# Altium project TINYMODULE-V3.PrjPcb
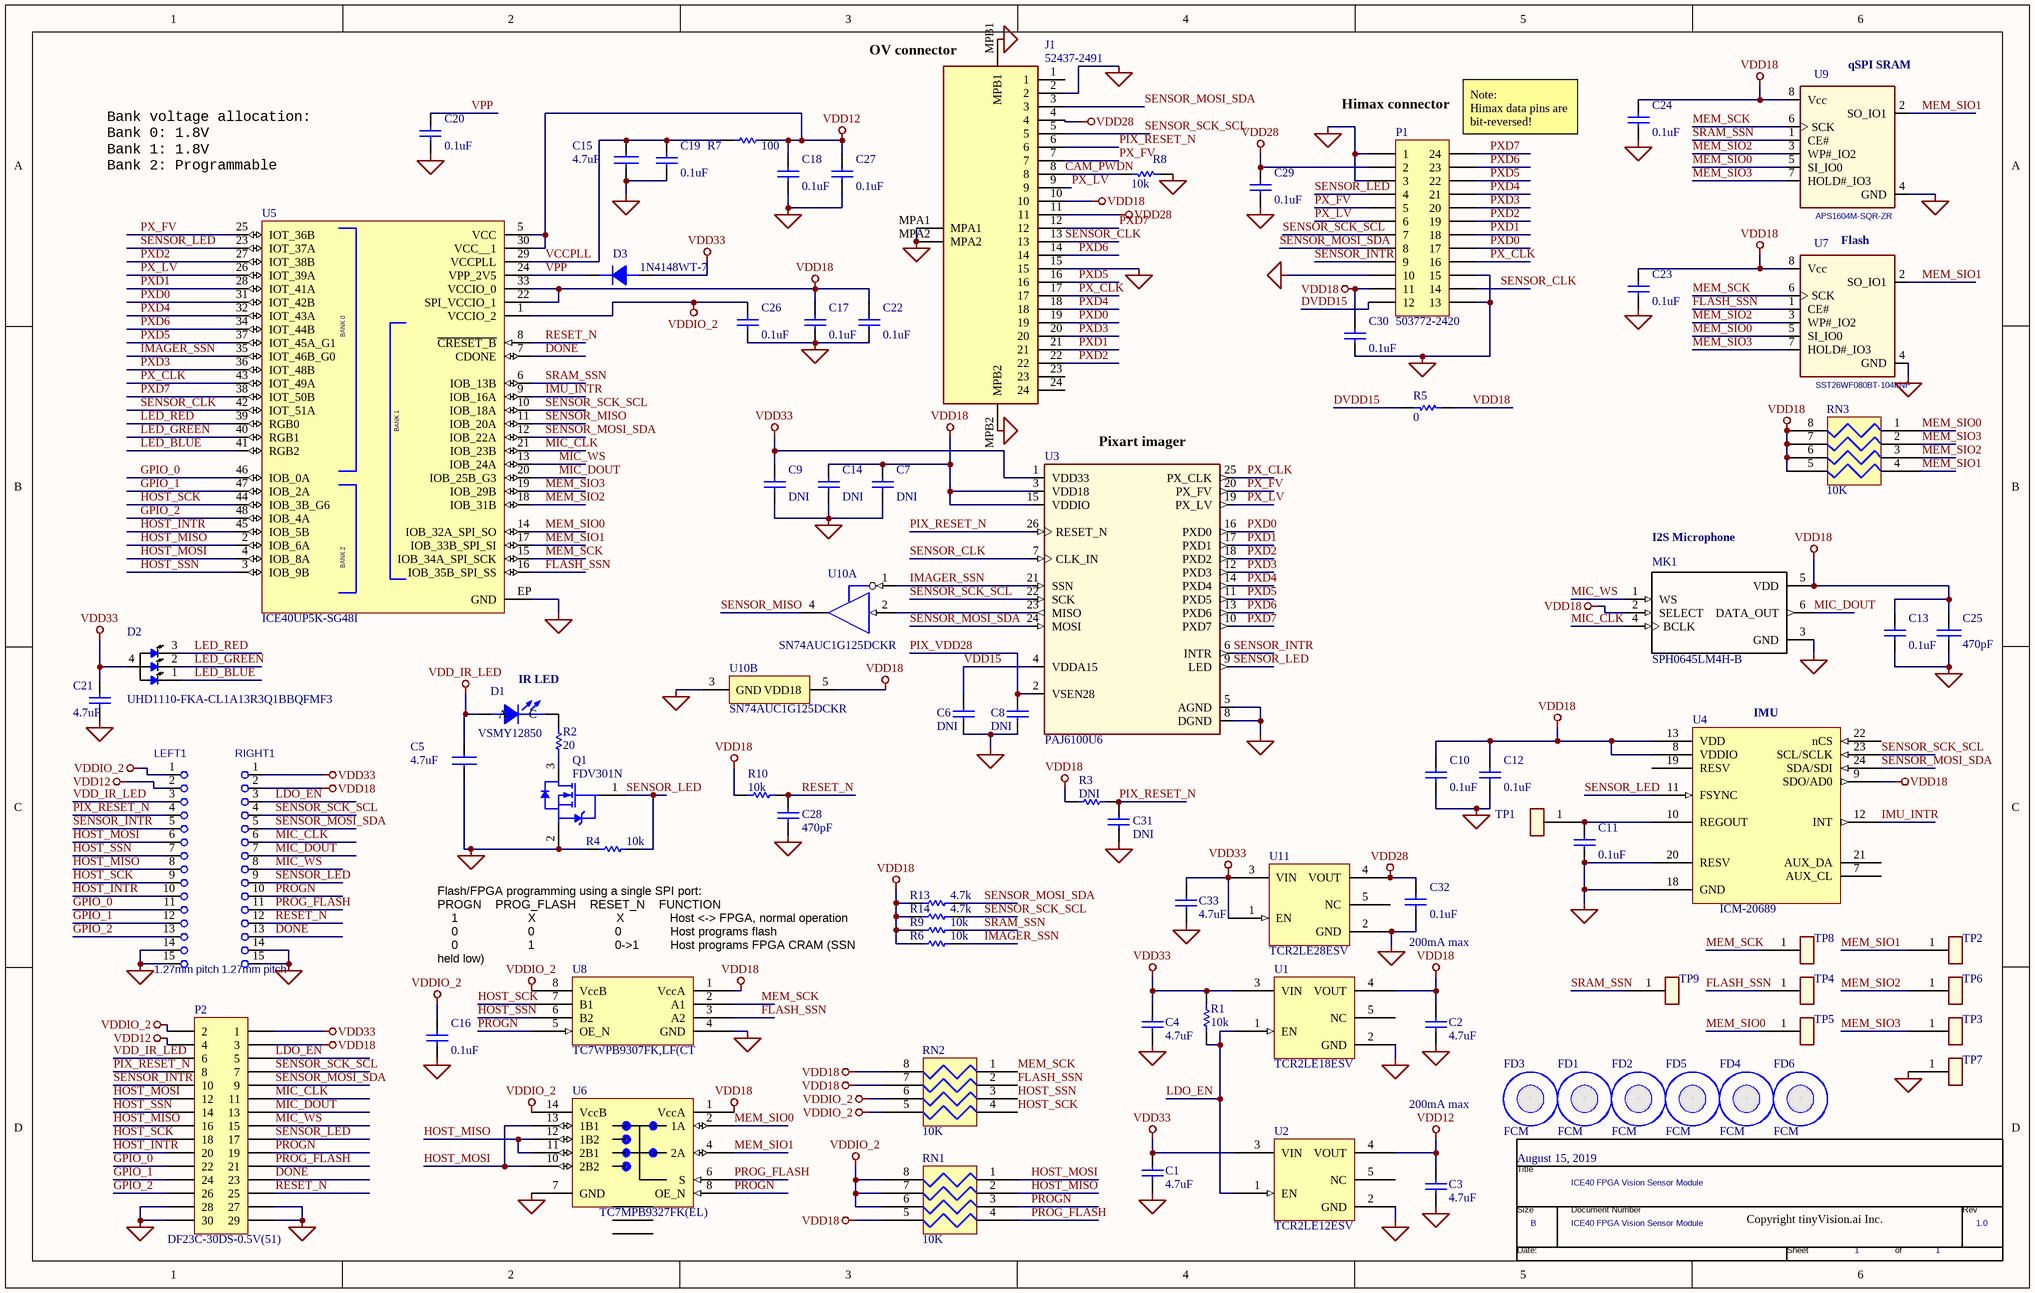
[diagram p0: TINYMODULE-V3.SchDoc]
1 sheet, 85 parts. Net scope: global (net labels, ports and power ports of the same name join across sheets).
Board file: TINYMODULE-V3.PcbDoc

## Sheet TINYMODULE-V3.SchDoc
size B

### Parts
*  Page Create Date: August 15, 2019  Page Count: 1  Page Size: B  Title: ICE40 FPGA Vision Sensor Module  RevCode: 1.0  (hidden comment: TitleBlock0)  (graphical)
C1  4.7uF  [CAPC100X50X60L25N]
C2  4.7uF  [CAPC100X50X60L25N]
C3  4.7uF  [CAPC100X50X60L25N]
C4  4.7uF  [CAPC100X50X60L25N]
C5  4.7uF  [CAPC100X50X60L25N]
C6  DNI  [CAPC100X50X60L25N]
C7  DNI  [CAPC100X50X60L25N]
C8  DNI  [CAPC100X50X60L25N]
C9  DNI  [CAPC100X50X60L25N]
C10  0.1uF  [CAPC100X50X60L25N]
C11  0.1uF  [CAPC100X50X60L25N]
C12  0.1uF  [CAPC100X50X60L25N]
C13  0.1uF  [CAPC100X50X60L25N]
C14  DNI  [CAPC100X50X60L25N]
C15  4.7uF  [CAPC100X50X60L25N]
C16  0.1uF  [CAPC100X50X60L25N]
C17  0.1uF  [CAPC100X50X60L25N]
C18  0.1uF  [CAPC100X50X60L25N]
C19  0.1uF  [CAPC100X50X60L25N]
C20  0.1uF  [CAPC100X50X60L25N]
C21  4.7uF  [CAPC100X50X60L25N]
C22  0.1uF  [CAPC100X50X60L25N]
C23  0.1uF  [CAPC100X50X60L25N]
C24  0.1uF  [CAPC100X50X60L25N]
C25  470pF  [CAPC100X50X60L25N]
C26  0.1uF  [CAPC100X50X60L25N]
C27  0.1uF  [CAPC100X50X60L25N]
C28  470pF  [CAPC100X50X60L25N]
C29  0.1uF  [CAPC100X50X60L25N]
C30  0.1uF  [CAPC100X50X60L25N]
C31  DNI  [CAPC100X50X60L25N]
C32  0.1uF  [CAPC100X50X60L25N]
C33  4.7uF  [CAPC100X50X60L25N]
D1  VSMY12850  [vsmy12850]
D2  UHD1110-FKA-CL1A13R3Q1BBQFMF3  [UHD1110-FKA]
D3  1N4148WT-7  [SOD523F]
FD1  FCM  [FID100X200N]
FD2  FCM  [FID100X200N]
FD3  FCM  [FID100X200N]
FD4  FCM  [FID100X200N]
FD5  FCM  [FID100X200N]
FD6  FCM  [FID100X200N]
J1  52437-2491  [524372491]
LEFT1  value 1.27mm pitch  [CONN_GENERIC_1.27mm_15cont]  (hidden comment: CONN_GENERIC_15)
MK1  SPH0645LM4H-B  [Knowles_SPH0645LM4H-B_0]
P1  503772-2420  [503772-2410]
P2  DF23C-30DS-0.5V(51)  [DF23C-30DS-0.5V]
Q1  FDV301N  [FAIR-SOT23-3_V]
R1  10k  [RESC100X50X40L25N]
R2  20  [RESC1608X55N]
R3  DNI  [RESC100X50X40L25N]
R4  10k  [RESC100X50X40L25N]
R5  0  [RESC100X50X40L25N]
R6  10k  [RESC100X50X40L25N]
R7  100  [RESC100X50X40L25N]
R8  10k  [RESC100X50X40L25N]
R9  10k  [RESC100X50X40L25N]
R10  10k  [RESC100X50X40L25N]
R13  4.7k  [RESC100X50X40L25N]
R14  4.7k  [RESC100X50X40L25N]
RIGHT1  value 1.27mm pitch  [CONN_GENERIC_1.27mm_15cont]  (hidden comment: CONN_GENERIC_15)
RN1  10K  [RESCAXS50P100X200X45-8NA]
RN2  10K  [RESCAXS50P100X200X45-8NA]
RN3  10K  [RESCAXS50P100X200X45-8NA]
TP1  TEST POINT  [TP-R20]  (value not drawn)
TP2  TEST POINT  [TP-R20]  (value not drawn)
TP3  TEST POINT  [TP-R20]  (value not drawn)
TP4  TEST POINT  [TP-R20]  (value not drawn)
TP5  TEST POINT  [TP-R20]  (value not drawn)
TP6  TEST POINT  [TP-R20]  (value not drawn)
TP7  TEST POINT  [TP-R20]  (value not drawn)
TP8  TEST POINT  [TP-R20]  (value not drawn)
TP9  TEST POINT  [TP-R20]  (value not drawn)
U1  TCR2LE18ESV  [SOT-553]
U2  TCR2LE12ESV  [SOT-553]
U3  PAJ6100U6  [lga26]
U4  ICM-20689  [QFN50P400X400X95-25N]
U5  ICE40UP5K-SG48I  [SLAB-QFN48-7X7-MD]
U6  TC7MPB9327FK(EL)  [VSSOP14-P-0030-0.50]
U7  SST26WF080BT-104I/NP  [SON50P300X200X60-9N]
U8  TC7WPB9307FK,LF(CT  [SSOP8-P-0.50A]
U9  APS1604M-SQR-ZR  [SON50P300X200X60-9N]
U10  SN74AUC1G125DCKR  [DCK0005A_L]  (parts A,B of 2)
U11  TCR2LE28ESV  [SOT-553]

### Nets
GND_SIGNAL: C1.1 C2.1 C3.1 C4.1 C5.2 C6.1 C7.2 C8.1 C9.2 C10.2 C11.2 C12.2 C13.2 C14.2 C15.2 C16.2 C17.2 C18.2 C19.2 C20.2 C21.1 C22.2 C23.2 C24.2 C25.2 C26.2 C27.2 C28.2 C29.2 C30.2 C31.2 C32.2 C33.1 J1.2 J1.15 J1.MPA1 J1.MPA2 J1.MPB1 J1.MPB2 LEFT1.14 LEFT1.15 MK1.3(GND) P1.1 P1.3 P1.10 P1.13 P1.15 P2.27 P2.28 P2.29 P2.30 Q1.2(S) R4.2 R8.1 RIGHT1.14 RIGHT1.15 TP7.1 U1.2(GND) U2.2(GND) U3.5(AGND) U3.8(DGND) U4.18(GND) U4.20(RESV) U5.EP(GND) U6.7(GND) U7.4(GND) U8.4(GND) U9.4(GND) U10.3(GND) U11.2(GND)
VDD12: C3.2 C18.1 C27.1 LEFT1.2 P2.4 R7.2 U2.4(VOUT) U5.5(VCC) U5.30(VCC__1)
VDD18: C2.2 C7.1 C10.1 C12.1 C13.1 C14.1 C17.1 C22.1 C23.1 C24.1 C25.1 C30.1 J1.10 MK1.2(SELECT) MK1.5(VDD) P1.11 P2.3 R3.1 R5.1 R6.2 R9.2 R10.1 R13.2 R14.2 RIGHT1.2 RN1.5 RN2.7 RN2.8 RN3.5 RN3.6 RN3.7 RN3.8 U1.4(VOUT) U3.3(VDD18) U3.15(VDDIO) U4.8(VDDIO) U4.9(SDO/AD0) U4.13(VDD) U5.22(SPI_VCCIO_1) U5.33(VCCIO_0) U6.1(VccA) U7.8(Vcc) U8.1(VccA) U9.8(Vcc) U10.5(VDD18)
VDD28: C29.1 C32.1 J1.4 J1.11 P1.2 U11.4(VOUT)
VDD33: C1.2 C4.2 C9.1 C21.2 C33.2 D2.4(ANODE) D3.A P2.1 R1.2 RIGHT1.1 U1.3(VIN) U2.3(VIN) U3.1(VDD33) U11.1(EN) U11.3(VIN)
VDD_IR_LED: C5.1 D1.A LEFT1.3 P2.6
VDDIO_2: C16.1 C26.1 LEFT1.1 P2.2 RN1.6 RN1.7 RN1.8 RN2.5 RN2.6 U5.1(VCCIO_2) U6.14(VccB) U8.8(VccB)
CAM_PWDN: J1.8 R8.2
DONE: P2.23 RIGHT1.13 U5.7(CDONE)
DVDD15: P1.12 R5.2
FLASH_SSN: RN2.2 TP4.1 U5.16(IOB_35B_SPI_SS) U7.1(CE#) U8.3(A2)
GPIO_0: LEFT1.11 P2.22 U5.46(IOB_0A)
GPIO_1: LEFT1.12 P2.24 U5.47(IOB_2A)
GPIO_2: LEFT1.13 P2.26 U5.48(IOB_4A)
HOST_INTR: LEFT1.10 P2.20 U5.45(IOB_5B)
HOST_MISO: LEFT1.8 P2.16 RN1.2 U5.2(IOB_6A) U6.11(2B1) U6.12(1B2)
HOST_MOSI: LEFT1.6 P2.12 RN1.1 U5.4(IOB_8A) U6.10(2B2) U6.13(1B1)
HOST_SCK: LEFT1.9 P2.18 RN2.4 U5.44(IOB_3B_G6) U8.7(B1)
HOST_SSN: LEFT1.7 P2.14 RN2.3 U5.3(IOB_9B) U8.6(B2)
IMAGER_SSN: R6.1 U3.21(SSN) U5.35(IOT_46B_G0) U10.1(~{OE})
IMU_INTR: U4.12(INT) U5.9(IOB_16A)
LDO_EN: P2.5 R1.1 RIGHT1.3 U1.1(EN) U2.1(EN)
LED_BLUE: D2.1(BLUE) U5.41(RGB2)
LED_GREEN: D2.2(GREEN) U5.40(RGB1)
LED_RED: D2.3(RED) U5.39(RGB0)
MEM_SCK: RN2.1 TP8.1 U5.15(IOB_34A_SPI_SCK) U7.6(SCK) U8.2(A1) U9.6(SCK)
MEM_SIO0: RN3.1 TP5.1 U5.14(IOB_32A_SPI_SO) U6.2(1A) U7.5(SI_IO0) U9.5(SI_IO0)
MEM_SIO1: RN3.4 TP2.1 U5.17(IOB_33B_SPI_SI) U6.4(2A) U7.2(SO_IO1) U9.2(SO_IO1)
MEM_SIO2: RN3.3 TP6.1 U5.18(IOB_31B) U7.3(WP#_IO2) U9.3(WP#_IO2)
MEM_SIO3: RN3.2 TP3.1 U5.19(IOB_29B) U7.7(HOLD#_IO3) U9.7(HOLD#_IO3)
MIC_CLK: MK1.4(BCLK) P2.11 RIGHT1.6 U5.21(IOB_23B)
MIC_DOUT: MK1.6(DATA_OUT) P2.13 RIGHT1.7 U5.20(IOB_25B_G3)
MIC_WS: MK1.1(WS) P2.15 RIGHT1.8 U5.13(IOB_24A)
PIX_RESET_N: C31.1 J1.6 LEFT1.4 P2.8 R3.2 U3.26(RESET_N)
PIX_VDD28: C8.2 U3.2(VSEN28)
PROG_FLASH: P2.21 RIGHT1.11 RN1.4 U6.6(S)
PROGN: P2.19 RIGHT1.10 RN1.3 U6.8(OE_N) U8.5(OE_N)
PX_CLK: J1.17 P1.16 U3.25(PX_CLK) U5.43(IOT_49A)
PX_FV: J1.7 P1.5 U3.20(PX_FV) U5.25(IOT_36B)
PX_LV: J1.9 P1.6 U3.19(PX_LV) U5.26(IOT_39A)
PXD0: J1.19 P1.17 U3.16(PXD0) U5.31(IOT_42B)
PXD1: J1.21 P1.18 U3.17(PXD1) U5.28(IOT_41A)
PXD2: J1.22 P1.19 U3.18(PXD2) U5.27(IOT_38B)
PXD3: J1.20 P1.20 U3.12(PXD3) U5.36(IOT_48B)
PXD4: J1.18 P1.21 U3.14(PXD4) U5.32(IOT_43A)
PXD5: J1.16 P1.22 U3.11(PXD5) U5.37(IOT_45A_G1)
PXD6: J1.14 P1.23 U3.13(PXD6) U5.34(IOT_44B)
PXD7: J1.12 P1.24 U3.10(PXD7) U5.38(IOT_50B)
RESET_N: C28.1 P2.25 R10.2 RIGHT1.12 U5.8(~{CRESET_B})
SENSOR_CLK: J1.13 P1.14 U3.7(CLK_IN) U5.42(IOT_51A)
SENSOR_INTR: LEFT1.5 P1.9 P2.10 U3.6(INTR)
SENSOR_LED: P1.4 P2.17 Q1.1(G) R4.1 RIGHT1.9 U3.9(LED) U4.11(FSYNC) U5.23(IOT_37A)
SENSOR_MISO: U5.11(IOB_20A) U10.4(Y)
SENSOR_MOSI_SDA: J1.3 P1.8 P2.9 R13.1 RIGHT1.5 U3.24(MOSI) U4.24(SDA/SDI) U5.12(IOB_22A)
SENSOR_SCK_SCL: J1.5 P1.7 P2.7 R14.1 RIGHT1.4 U3.22(SCK) U4.23(SCL/SCLK) U5.10(IOB_18A)
SRAM_SSN: R9.1 TP9.1 U5.6(IOB_13B) U9.1(CE#)
VCCPLL: C15.1 C19.1 R7.1 U5.29(VCCPLL)
VDD15: C6.2 U3.4(VDDA15)
VPP: C20.1 D3.K U5.24(VPP_2V5)
NetC11_1: C11.1 TP1.1 U4.10(REGOUT)
NetD1_C: D1.C R2.2
NetQ1_3: Q1.3(D) R2.1
NetU3_23: U3.23(MISO) U10.2(A)

Not connected (* = marked no-connect by the designer): FD1 1; FD2 1; FD3 1; FD4 1; FD5 1; FD6 1; J1 1 23 24; U1 5(NC); U2 5(NC); U4 1(NC) 2(NC) 3(NC) 4(NC) 5(NC) 6(NC) 7(AUX_CL) 14(NC) 15(NC) 16(NC) 17(NC) 19(RESV) 21(AUX_DA) 22(nCS); U6 3(NC) 5(NC) 9(NC); U11 5(NC)

### Notes on the sheet
- (near J1) OV connector
- (near U9) qSPI SRAM
- (near P1) Himax connector
- (near P1) Note:
  Himax data pins are bit-reversed!
- Bank voltage allocation:
  Bank 0: 1.8V
  Bank 1: 1.8V
  Bank 2: Programmable
- (near U7) Flash
- (near U3) Pixart imager
- (near MK1) I2S Microphone
- IR LED
- (near U4) IMU
- Flash/FPGA programming using a single SPI port:
  PROGN    PROG_FLASH    RESET_N    FUNCTION
  1                    X                       X             Host <-> FPGA, normal operation
  0                    0                       0              Host programs flash
  0                    1                       0->1         Host programs FPGA CRAM (SSN held low)
- (near C32) 200mA max
- 200mA max
- Copyright tinyVision.ai Inc.
- Labels drawn without touching a wire or pin: VDD18
- (in symbol ICE40UP5K-SG48I) BANK 0; BANK 1; BANK 2
- (in symbol TitleBlock0) Title; Size; Document Number; Rev; Date:; Sheet; of

### Library data of the parts
C1-C4 C21 C33 = Cap_1uF_X5R_10%_6V3_0402: CAP CER 4.7UF 6.3V X5R 0402; Manufacturer Part Number: GRM155R60J475ME87J; Manufacturer: Murata Electronics; Part #: E-CAP-042; Digi-Key Part Number: 490-18211-1-ND; Package: 0402
C5 C15 = CAP NP: CAP CER 4.7UF 6.3V X5R 0402; Manufacturer Part Number: GRM155R60J475ME87J; Manufacturer: Murata Electronics; Part #: S-CAP-024; Digi-Key Part Number: 490-18211-1-ND; Package: 0402
C6 C8 = Cap_1uF_X5R_10%_6V3_0402: CAP CER 4.7UF 10V X5R 0402; Part #: E-CAP-042; Package: 0402
C7 C9 C14 C31 = Cap_100nF_X7R_10%_0402: CAP CER 0.1UF 6.3V X5R 0402; Part #: E-CAP-003; Package: 0402
C10-C13 C16-C20 C22-C24 C26 C27 C29 C30 C32 = Cap_100nF_X7R_10%_0402: CAP CER 0.1UF 10V X5R 0402; Manufacturer Part Number: GRM155R61A104KA01J; Manufacturer: Murata Electronics; Part #: E-CAP-003; Digi-Key Part Number: 490-6297-1-ND; Package: 0402
C25 = CAP: CAP CER 470PF 50V X7R 0402; Manufacturer Part Number: GRM155R71H471KA01D; Manufacturer: Murata Electronics; Part #: E-CAP-023; Digi-Key Part Number: 490-1300-1-ND; Price 100: 0.03250; Emcraft #: E-CAP-023; Price 1000: 0.0066; Price 5000: 0.0055; Package: 0402
C28 = Cap_100nF_X7R_10%_0402: CAP CER 470PF 50V X7R 0402; Manufacturer Part Number: GRM155R71H471KA01D; Manufacturer: Murata Electronics; Part #: E-CAP-003; Digi-Key Part Number: 490-1300-1-ND; Package: 0402
D1 = LED: EMITTER IR 850NM 70MA 3.20MM SMD; Manufacturer: OSRAM Opto Semiconductors Inc.; ManType: SFH 4253-Z; Viewing Angle: 80°; Forward Current: 20mA; Forward Voltage: 1.4V; Rise Time: 10ns; Touchscreen: Infrared (IR); Digi-Key Part Number: VSMY12850CT-ND; Part #: *; Supplier 1: Avnet; Manufacturer Part Number: VSMY12850; Stock 1: 0; Pricing 1: 1=0.404 (USD); Mount: Surface Mount; Case/Package: 1206; Case Code (Metric): 3216; Case Code (Imperial): 1206; Min Operating Temperature: -40°C; Max Operating Temperature: 85°C; Packaging: Cut Tape; Wavelength: 850nm; Orientation: Top View; REACH SVHC: Unknown; Lead Free: Lead Free
D2 = UHD1110-FKA-CL1A13R3Q1BBQFMF3: HB, SMD, RGB; Manufacturer: Cree Inc.; Price: None; Manufacturer Part Number: UHD1110-FKA-CL1A13R3Q1BBQFMF3; Digi-Key Part Number: UHD1110-FKA-CL1A13R3Q1BBQFMF3CT-ND; Package: 0404 Cree Inc.; Value: *
D3 = DIODE: DIODE GEN PURP 80V 125MA SOD523; Manufacturer: Diodes Incorporated; Digi-Key Part Number: 1N4148WTDICT-ND; Manufacturer Part Number: 1N4148WT-7; Package: SOD523
FD1-FD6 = FCM: Fiducial marker; Part #: NA; Notes: DNI; ManType: NA
J1 = 52437-2491: Connector; Manufacturer_Name: Molex; Datasheet Link: https://www.molex.com/pdm_docs/sd/524372491_sd.pdf; Height: 2mm; Manufacturer Part Number: 52437-2491; Arrow Part Number: 52437-2491; Mouser Part Number: 538-52437-2491; Mouser Price/Stock: https://www.mouser.com/Search/Refine.aspx?Keyword=538-52437-2491
MK1 = SPH0645LM4H-B: CRAWFORD MIC DGT I2S BOTTOM PORT; Manufacturer: Knowles; Package: SIP-7 Bourns; Manufacturer Part Number: SPH0645LM4H-B; Digi-Key_Purchase_URL: https://www.digikey.com/product-detail/en/knowles/SPH0645LM4H-B/423-1405-1-ND/5332432?utm_source=snapeda&utm_medium=aggregator&utm_campaign=symbol; Digi-Key Part Number: 423-1405-1-ND; SnapEDA_Link: https://www.snapeda.com/parts/SPH0645LM4H-B/Knowles/view-part/?ref=snap; Value: *
P1 = Header 12X2A: CONN RCPT 24POS SMD GOLD; Manufacturer: Molex; Manufacturer Part Number: 5037722420; Number of Positions: 24; Digi-Key Part Number: WM25543CT-ND; Mount: Surface Mount; ComponentLink1URL: http://portal.fciconnect.com/Comergent//fci/drawing/10117319.pdf?src-supplier=Digi-Key; ComponentLink1Description: http://portal.fciconnect.com/Comergent//fci/drawing/10117319.pdf?src-supplier=Digi-Key
P2 = Header 15X2: Header, 15-Pin, Dual row; Manufacturer: Hirose; Number of Contacts: 30; Current Rating: 300mA; Voltage Rating: 50V; Connector Type: Receptacle,PCB; Insulation Resistance: 500MR; Gender: Receptacle; Pitch: 0.5mm; Row Spacing: 6mm; Mated Stacking Heights: 1.5mm; LatestRevisionDate: 17-Jul-2002; LatestRevisionNote: Re-released for DXP Platform.; Publisher: Altium Limited; Supplier 1: Mouser; Supplier Part Number 1: 798-DF23C30DS05V51; Manufacturer Part Number: DF23C-30DS-0.5V(51); Stock 1: 2289; Pricing 1: 1=0.96, 10=0.792, 50=0.792, 100=0.727, 1000=0.528, 10000=0.43 (USD); Mount: Surface Mount; Contact Plating: Gold; Contact Material: Bronze,Copper Alloy; Housing Color: Black; Housing Material: Polymer; Min Operating Temperature: -35°C; Max Operating Temperature: 85°C; Number of Rows: 2; Termination: SMD/SMT; Package Quantity: 1; Packaging: Tape and Reel; Number of Positions: 30; Orientation: Straight; REACH SVHC: No SVHC; Lead Free: Lead Free; Flammability Rating: UL94 V-0; ComponentLink1URL: https://www.hirose.com/product/en/download_file/key_name/DF23/category/Catalog/doc_file_id/49660/?file_category_id=4&item_id=246&is_series=1&src-supplier=Digi-Key; ComponentLink1Description: https://www.hirose.com/product/en/download_file/key_name/DF23/category/Catalog/doc_file_id/49660/?file_category_id=4&item_id=246&is_series=1&src-supplier=Digi-Key; ComponentLink2URL: http://www.farnell.com/datasheets/1910197.pdf?src-supplier=Element14; ComponentLink2Description: http://www.farnell.com/datasheets/1910197.pdf?src-supplier=Element14; ComponentLink3URL: http://www.hirose.co.jp/cataloge_hp/e68801060.pdf?src-supplier=Avnet+Europe; ComponentLink3Description: http://www.hirose.co.jp/cataloge_hp/e68801060.pdf?src-supplier=Avnet+Europe; ComponentLink4URL: http://www.mouser.com/ds/2/185/DF23_catalog-939018.pdf?src-supplier=Mouser; ComponentLink4Description: http://www.mouser.com/ds/2/185/DF23_catalog-939018.pdf?src-supplier=Mouser; ComponentLink5URL: https://www.hirose.com/product/en/download_file/key_name/DF23C-30DS-0.5V%2851%29/category/Specification%20Sheet/doc_file_id/47546/?file_category_id=9&item_id=06880302851&is_series=&src-supplier=Digi-Key; ComponentLink5Description: https://www.hirose.com/product/en/download_file/key_name/DF23C-30DS-0.5V%2851%29/category/Specification%20Sheet/doc_file_id/47546/?file_category_id=9&item_id=06880302851&is_series=&src-supplier=Digi-Key; ComponentLink6URL: http://www.hirose.co.jp/cataloge_hp/e68801060.pdf?src-supplier=Future+Electronics; ComponentLink6Description: http://www.hirose.co.jp/cataloge_hp/e68801060.pdf?src-supplier=Future+Electronics; ComponentLink7URL: http://www.hirose.co.jp/cataloge_hp/e68801060.pdf?src-supplier=Avnet; ComponentLink7Description: http://www.hirose.co.jp/cataloge_hp/e68801060.pdf?src-supplier=Avnet
Q1 = NEMOS-GSD-3_D: MOSFET N-CH 25V 220MA SOT-23; Manufacturer: ON Semiconductor; Rds(on) Test Voltage Vgs: 2.7V; Threshold Voltage Vgs Typ: 850mV; Reel Quantity: 3000; Voltage Vgs Rds on Measurement: 4.5V; Power Dissipation Pd: 350mW; Transistor Polarity: NChannel; No. of Transistors: 1; Package Version: Rev. 12, 03/2016; Voltage Vgs th Max: 1.5V; ESD HBM: 6kV; Pulse Current Idm: 500mA; Current Temperature: 25degC; On Resistance Rds(on): 5ohm; External Depth: 2.5mm; SMD Marking: 301; No. of Pins: 3; External Width: 3.05mm; SVHC: NoSVHC(19-Dec-2012); External Length / Height: 1.12mm; Termination Type: SMD; Voltage Vds Typ: 25V; Transistor Case Style: SOT-23; Continuous Drain Current Id: 220mA; Package Reference: SOT23-3; Package URL: http://www.fairchildsemi.com/dwg/MA/MA03D.pdf; Voltage Vgs Max: 850mV; Drain Source Voltage Vds: 25V; Operating Temperature Max: 150degC; Package Description: 3-Pin Small Outline Transistor, Body 2.92 x 1.325 mm, Pitch 0.95 mm; Operating Temperature Min: -55degC; Datasheet Version: Jun-09; Tape Width: 8mm; Full Power Rating Temperature: 25degC; Manufacturer Part Number: FDV301N; Package / Case: SOT-23; Digi-Key Part Number: FDV301NCT-ND; Current Id Max: 220mA; Operating Temperature Range: -55degCto+150degC
R1 R4 R6 R8-R10 = Res_10K_1%_0402: RES 10K OHM 1/16W 5% 0402; Manufacturer Part Number: RMCF0402JT10K0; Manufacturer: STACKPOLE; Part #: E-RES-003; Package: 0402; Digi-Key Part Number: RMCF0402JT10K0CT-ND
R2 = Res_10K_1%_0402: RES 20 OHM 5% 1/16W 0402; Manufacturer Part Number: RMCF0402JT20R0; Manufacturer: STACKPOLE; Part #: E-RES-003; Package: 0402; Digi-Key Part Number: RMCF0402JT20R0CT-ND
R3 = Res_10K_1%_0402: RES 10K OHM 1/16W 5% 0402; Part #: E-RES-003; Package: 0402
R5 = Res_10K_1%_0402: RES SMD 0 OHM JUMPER 1/16W 0402; Manufacturer Part Number: RC0402JR-070RL; Manufacturer: Yageo; Part #: E-RES-003; Package: 0402; Digi-Key Part Number: 311-0.0JRCT-ND
R7 = Res_100_1%_0402: RES 100 OHM 5% 1/16W 0402; Part #: E-RES-002; Manufacturer: STACKPOLE; Manufacturer Part Number: RMCF0402JT100R; Package: 0402; Digi-Key Part Number: RMCF0402JT100RCT-ND
R13 R14 = Res_10K_1%_0402: RES SMD 4.7K OHM 5% 1/16W 0402; Manufacturer Part Number: RC0402JR-074K7L; Manufacturer: Yageo; Part #: E-RES-003; Package: 0402; Digi-Key Part Number: 311-4.7KJRCT-ND
RN1-RN3 = EXB28V: RES ARRAY 4 RES 10K OHM 0804; Manufacturer: CTS Resistor Products; Manufacturer Part Number: 741C083103JP; Digi-Key Part Number: 741C083103JPCT-ND; Package: 0804
U1 U2 U11 = TCR2LE12ESV: Manufacturer: Toshiba
U3 = PAJ6100U6_DS: Camera Module; Manufacturer: PixArt Imaging Inc; Manufacturer Part Number: PAJ6100U6
U4 = MPU-6500: IMU ACCEL/GYRO/TEMP I2C/SPI QFN; Manufacturer: TDK InvenSense; Digi-Key Part Number: 1428-1059-1-ND; Manufacturer Part Number: ICM-20689
U5 = ICE40UP5K-SG48I: IC FPGA 39 I/O 48QFN; Manufacturer: Lattice Semiconductor; Manufacturer Part Number: ICE40UP5K-SG48I; Package: QFN-48 Lattice Semiconductor; Digi-Key Part Number: 220-2212-1-ND
U6 = TC7MPB9327FK: X34 DUAL-SUPPLY LEVEL SHIFT SPDT; Manufacturer: Toshiba Semiconductor and Storage; Digi-Key Part Number: TC7MPB9327FK(EL)CT-ND; Manufacturer Part Number: TC7MPB9327FK(EL)
U7 = IS25WQ040-JNLE: IC FLASH 8M SPI 104MHZ 8USON; Manufacturer: Microchip Technology; Digi-Key Part Number: SST26WF080BT-104I/NPCT-ND; Manufacturer Part Number: SST26WF080BT-104I/NP
U8 = TC7WPB9307FK: X34 GENERAL-PURPOSE BUS SWITCH L; Manufacturer: Toshiba Semiconductor and Storage; Digi-Key Part Number: TC7WPB9307FKLF(CTCT-ND; Manufacturer Part Number: TC7WPB9307FK,LF(CT
U9 = IS25WQ040-JNLE: qSPI SRAM; Manufacturer: APMEMORY
U10 = TI-SN74AXXXX1X125-5: IC BUF NON-INVERT 2.7 V SC70-5; Manufacturer: Texas Instruments; Technology Family: AUC; Schmitt Trigger: No; Bits(#): 1; Sub-Family: Non-Inverting Buffer/Driver; VCC(Max)(V): 2.7; Voltage(Nom)(V): 0.8,1.2,1.5,1.8,2.5; 3-State Output: Yes; F @ Nom Voltage(Max)(Mhz): 250; ICC @ Nom Voltage(Max)(mA): 0.01; VCC(Min)(V): 0.8; Input Type: CMOS; Output Drive (IOL/IOH)(Max)(mA): 9/-9; Rating: Catalog; Logic: True; tpd @ Nom Voltage(Max)(ns): 4.7,3.6,2.3,1.5,1.3; Digi-Key Part Number: 296-12658-1-ND; PackageReference: DCK0005A; Manufacturer Part Number: SN74AUC1G125DCKR; Operating Temperature Range(C): -40 to 85; Output Type: CMOS
* = TitleBlock0: Page Number: 1; Doc: ICE40 FPGA Vision Sensor Module